# EasyEDA Pro project ProPrj_stm32人脸识别门禁系统_2026-03-19.epro

# Schematic Schematic1
Assembly Variant: Basic; Board Name: Board1; Create Date: 2026-03-06; Page Name: P1; Project Name: stm32人脸识别门禁系统; Schematic Name: Schematic1; Update Date: 2026-03-06; BladeWidth: 10; Company: 嘉立创EDA; Page Size: A4; RegionStart: 1; ShowBorder: 1; TitleBlock: 1; TitleBlockPosition: 3; Version: V1.0; XRegionCount: 6; YRegionCount: 4
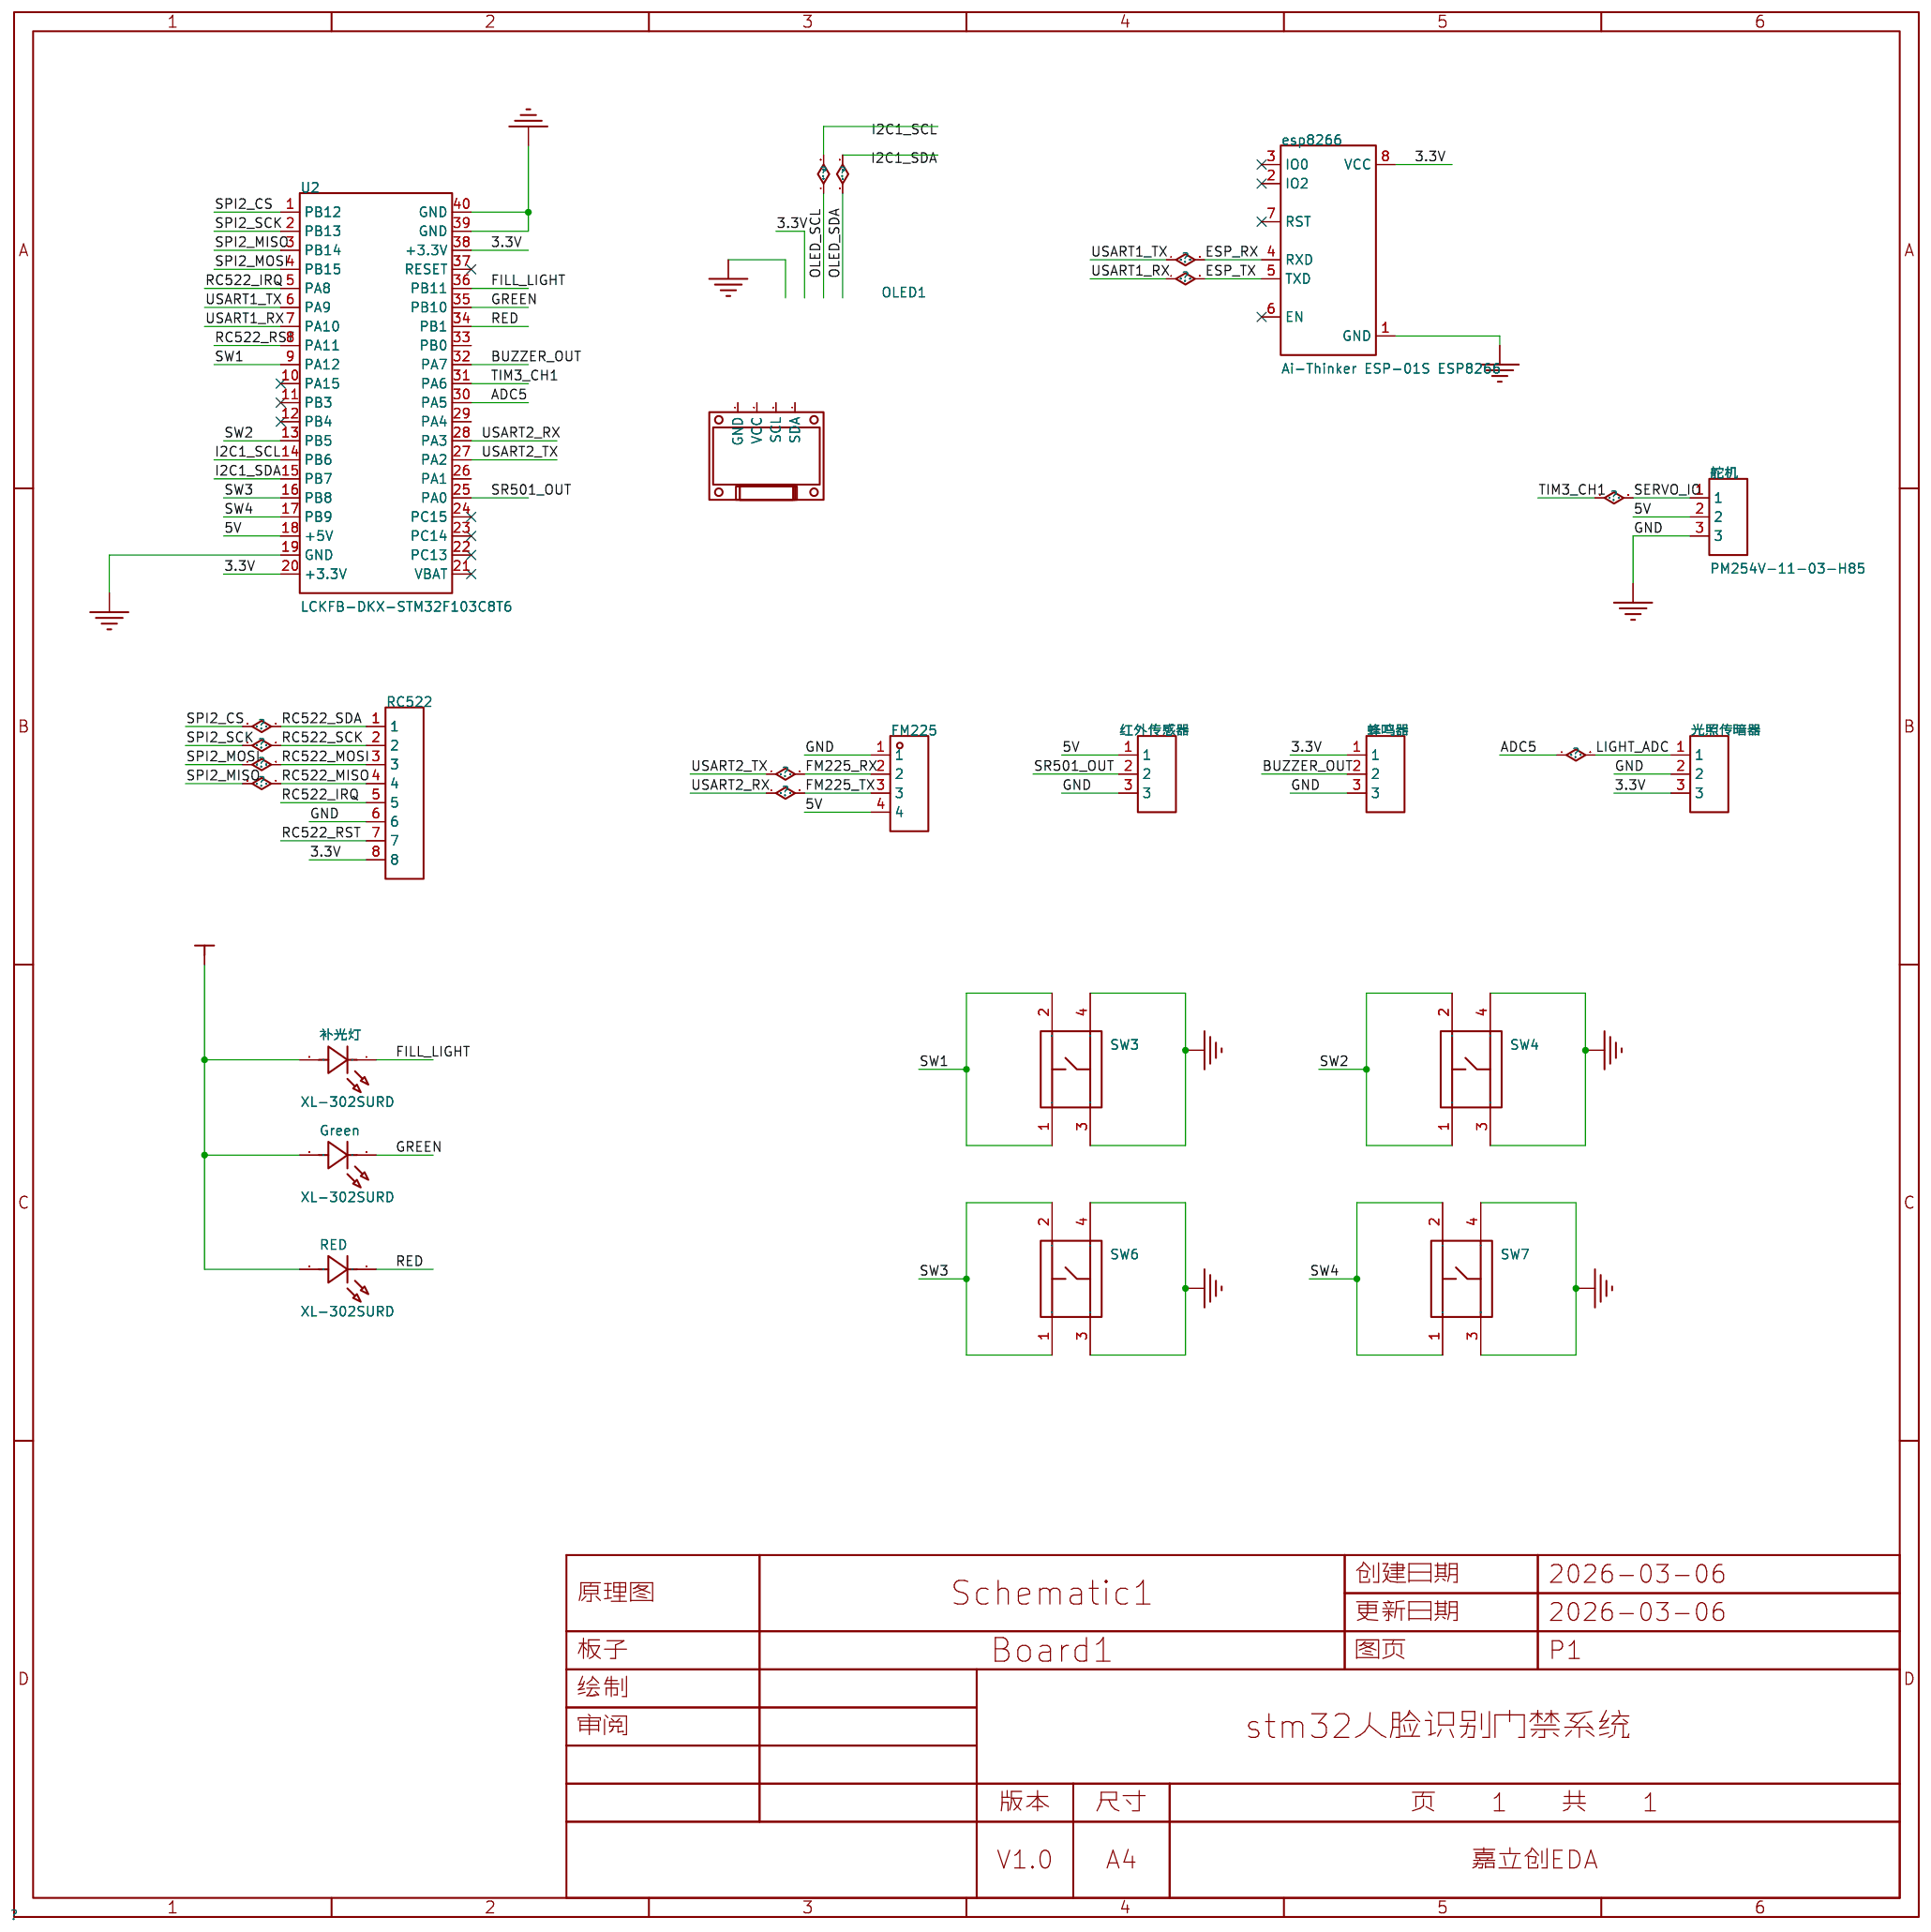
[diagram p0: schematic sheet]

## Parts
esp8266  Ai-Thinker ESP-01S ESP8266  [WIFIM-TH_8P-L24.7-W14.4-P2.54]
FM225  -  [HDR-TH_4P-P2.54-V-F]
Green  XL-302SURD  [LED-TH_BD3.8-P2.54-RD]
OLED1  -  [0.96OLED_4P]
RC522  -  [HDR-TH_8P-P2.54-V-F-1]
RED  XL-302SURD  [LED-TH_BD3.8-P2.54-RD]
SW3  K2-1102DP-C4SW-04  [KEY-TH_4P-L6.0-W6.0-P4.50-LS6.50]
SW4  K2-1102DP-C4SW-04  [KEY-TH_4P-L6.0-W6.0-P4.50-LS6.50]
SW6  K2-1102DP-C4SW-04  [KEY-TH_4P-L6.0-W6.0-P4.50-LS6.50]
SW7  K2-1102DP-C4SW-04  [KEY-TH_4P-L6.0-W6.0-P4.50-LS6.50]
U2  LCKFB-DKX-STM32F103C8T6  [CONN-TH_L53.3-W22.9_STM32F103C8T6-CARD]
光照传暗器  -  [HDR-TH_3P-P2.54-V-F]
红外传感器  -  [HDR-TH_3P-P2.54-V-F]
舵机  PM254V-11-03-H85  [HDR-TH_3P-P2.54-V-F]
蜂鸣器  -  [HDR-TH_3P-P2.54-V-F]
补光灯  XL-302SURD  [LED-TH_BD3.8-P2.54-RD]

## Library data of the parts
esp8266 = Ai-Thinker ESP-01S ESP8266: Supplier Part: C17606792; Manufacturer: Ai-Thinker(安信可); JLCPCB Part Class: Extended Part; Datasheet: https://item.szlcsc.com/datasheet/Ai-Thinker%2520ESP-01S%2520ESP8266/18736031.html; Supplier: LCSC
FM225 = HDR-F_2.54_1x4P: Supplier Part: C2718488; Supplier Footprint: 插件
Green RED 补光灯 = XL-302SURD: 灯头类型:3mm圆形灯头;发光颜色:红色;正向压降(Vf):2.2V;功率:50mW;正向电流:20mA;波长:620nm~630nm;二极管配置:-;透镜颜色:红色透镜;色温:-;发光强度:1000mcd;发光角度:35°;载带方式:-;工作温度:-20℃~+85℃;; LCSC Part Name: 3mm圆形灯头 红色; Supplier Part: C2895470; Manufacturer: XINGLIGHT(成兴光); Supplier Footprint: 插件,D=3mm; JLCPCB Part Class: Extended Part; Datasheet: https://item.szlcsc.com/datasheet/XL-302SURD/3136185.html; Supplier: LCSC; Lamp Holder Type: 3mm圆形灯头; Illumination Color: 红色; Voltage - Forward(Vf): 2.2V; Power(Watts): 50mW; Forward Current: 20mA; Wavelength - Dominant: 620nm~630nm; Peak Wavelength: 625nm; Lens Color: 红色透镜; Luminous Intensity: 1000mcd; Viewing Angle: 35°; Operating Temperature: -20℃~+85℃
OLED1 = 0.96OLED模块_4P: Supplier Footprint: 插件
RC522 = HDR-F_2.54_1x8P: Supplier Part: C27438; Supplier Footprint: 插件
SW3 SW4 SW6 SW7 = K2-1102DP-C4SW-04: 电路结构:单刀单掷;按钮形状:圆形按钮;作用力:2.5N;安装方式:直插;开关长度:6mm;开关宽度:6mm;开关高度:5mm;触点电流:50mA;额定电压:12V;带灯:-;工作寿命:10万次;; LCSC Part Name: 轻触按键开关6*6*5; Supplier Part: C110153; Manufacturer: 韩国韩荣; Supplier Footprint: 插件-4P,6x6mm; JLCPCB Part Class: Extended Part; Datasheet: https://item.szlcsc.com/datasheet/K2-1102DP-C4SW-04/111374.html; Supplier: LCSC; Circuit: 单刀单掷; Actuator Style: 圆形按钮; Operating Force: 2.5N; Mounting Type: 直插; Length: 6mm; Width: 6mm; Switch Height: 5mm; Contact Current: 50mA; Voltage Rating: 12V; Life: 10万次; Operating Temperature: -25℃~+85℃
U2 = LCKFB-DKX-STM32F103C8T6: 搭载Contex M3内核,程序存储容量64KB,RAM总容量20KB,最高72MHz主频,提供高效的计算能力和稳定的运行环境。; LCSC Part Name: 立创·地阔星-STM32F103C8T6开发板; Supplier Part: C22396880; Manufacturer: 立创开发板; JLCPCB Part Class: Extended Part; Datasheet: https://item.szlcsc.com/datasheet/LCKFB-DKX-STM32F103C8T6/24005615.html; Supplier: LCSC
光照传暗器 红外传感器 蜂鸣器 = HDR-F_2.54_1x3P: Supplier Part: C541850; Supplier Footprint: 插件
舵机 = PM254V-11-03-H85: 插孔结构:1x3P;间距:2.54mm;行距:-;圆孔/方孔:方孔;安装方式:直插;排数:单排;总孔位数:3P;额定电流:3A;插孔方向:顶部;塑高:8.5mm;触头材质:黄铜;触头镀层:-;工作温度:-40℃~+105℃;; LCSC Part Name: 1x3P 间距:2.54mm 直插; Supplier Part: C541850; Manufacturer: XFCN(兴飞); Supplier Footprint: 插件,P=2.54mm; JLCPCB Part Class: Extended Part; Datasheet: https://item.szlcsc.com/datasheet/PM254V-11-03-H85/562471.html; Supplier: LCSC; Holes Structure: 1x3P; Pitch: 2.54mm; Circular Hole / Square Hole: 方孔; Mounting Type: 直插; Number of Rows: 单排; Number of Positions: 3P; Current Rating: 3A; Holes Direction: 顶部; Insulation Height: 8.5mm; Contact Material: 黄铜; Operating Temperature: -40℃~+105℃

## Nets
3.3V: esp8266.8(VCC) Green.2(A) RC522.8 RED.2(A) U2.20(+3.3V) U2.38(+3.3V) 光照传暗器.3 蜂鸣器.1 补光灯.2(A)
5V: FM225.4 U2.18(+5V) 红外传感器.1 舵机.2
GND: esp8266.1(GND) FM225.1 RC522.6 SW3.3 SW3.4 SW4.3 SW4.4 SW6.3 SW6.4 SW7.3 SW7.4 U2.19(GND) U2.39(GND) U2.40(GND) 光照传暗器.2 红外传感器.3 舵机.3 蜂鸣器.3
ADC5: U2.30(PA5) 光照传暗器.1
BUZZER_OUT: U2.32(PA7) 蜂鸣器.2
ESP_RX: esp8266.4(RXD) U2.6(PA9)
ESP_TX: esp8266.5(TXD) U2.7(PA10)
FILL_LIGHT: U2.36(PB11) 补光灯.1(K)
FM225_RX: FM225.2 U2.27(PA2)
FM225_TX: FM225.3 U2.28(PA3)
GREEN: Green.1(K) U2.35(PB10)
I2C1_SCL: U2.14(PB6)
I2C1_SDA: U2.15(PB7)
RC522_IRQ: RC522.5 U2.5(PA8)
RC522_MISO: RC522.4 U2.3(PB14)
RC522_MOSI: RC522.3 U2.4(PB15)
RC522_RST: RC522.7 U2.8(PA11)
RC522_SCK: RC522.2 U2.2(PB13)
RC522_SDA: RC522.1 U2.1(PB12)
RED: RED.1(K) U2.34(PB1)
SERVO_IO: U2.31(PA6) 舵机.1
SR501_OUT: U2.25(PA0) 红外传感器.2
SW1: SW3.1 SW3.2 U2.9(PA12)
SW2: SW4.1 SW4.2 U2.13(PB5)
SW3: SW6.1 SW6.2 U2.16(PB8)
SW4: SW7.1 SW7.2 U2.17(PB9)

Not connected (* = marked no-connect by the designer): esp8266 2(IO2)* 3(IO0)* 6(EN)* 7(RST)*; OLED1 1(GND) 2(VCC) 3(SCL) 4(SDA); U2 10(PA15)* 11(PB3)* 12(PB4)* 21(VBAT)* 22(PC13)* 23(PC14)* 24(PC15)* 26(PA1) 29(PA4) 33(PB0) 37(RESET)*

# Board PCB1
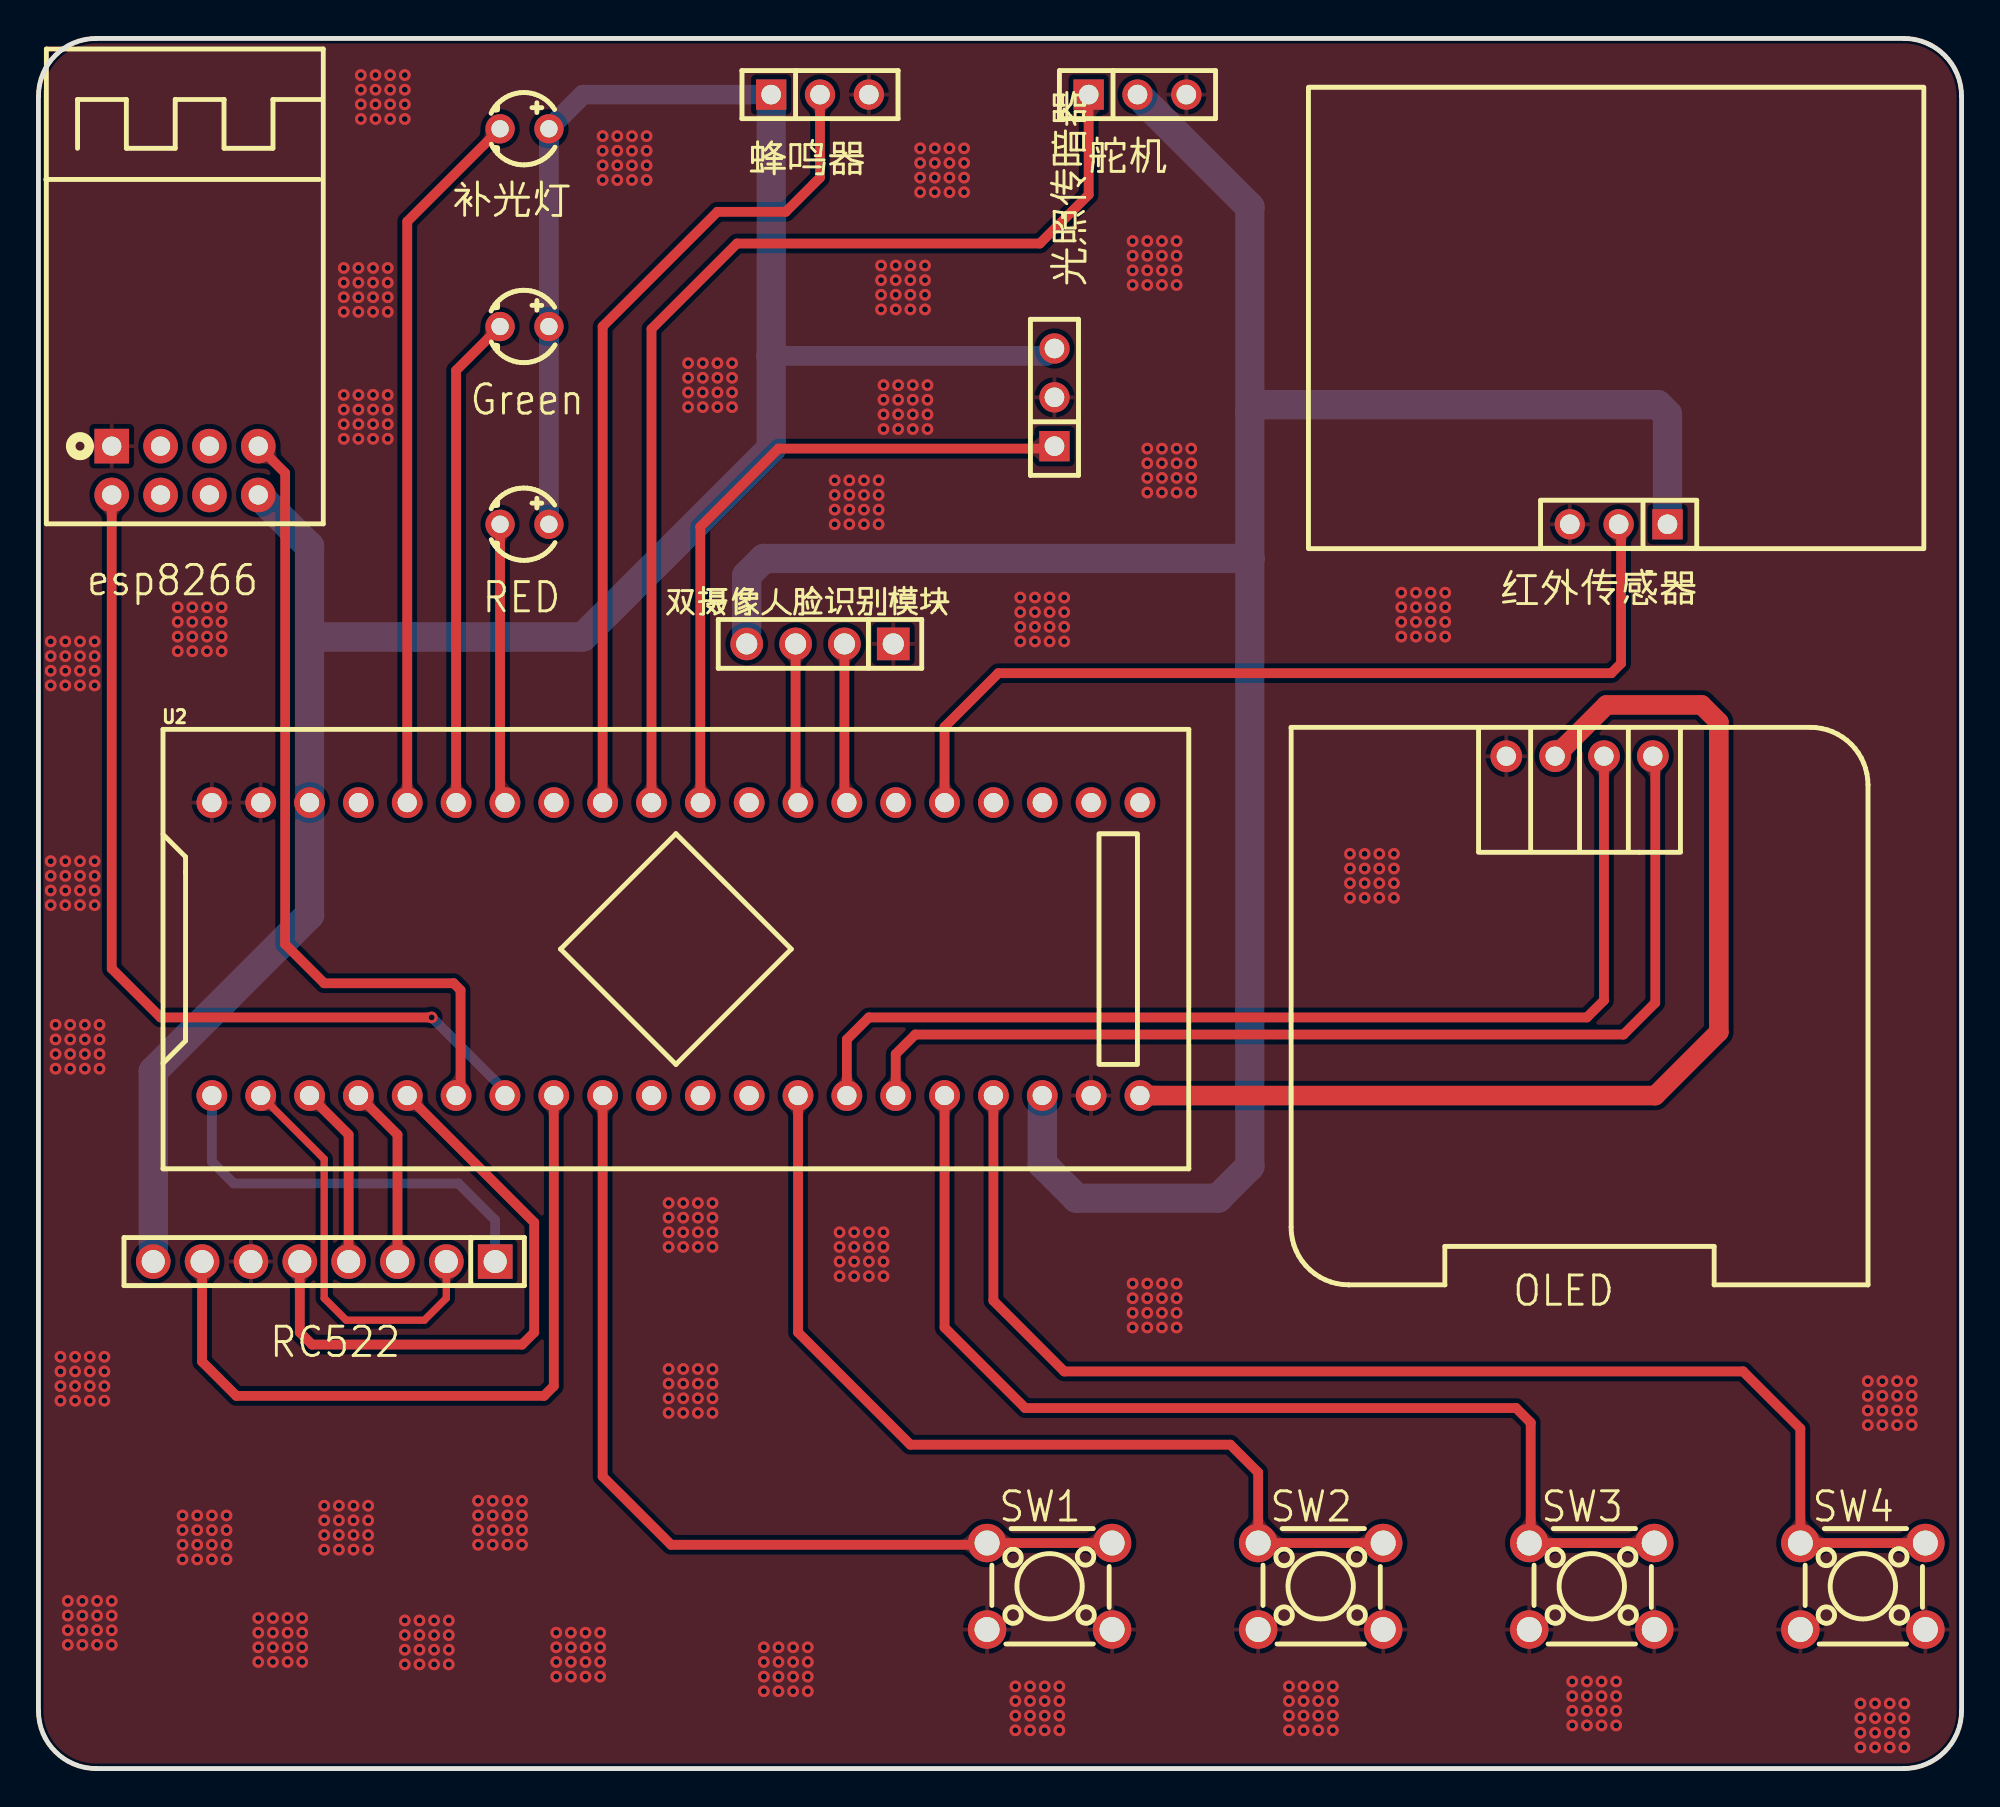
[diagram p1: board, top side]
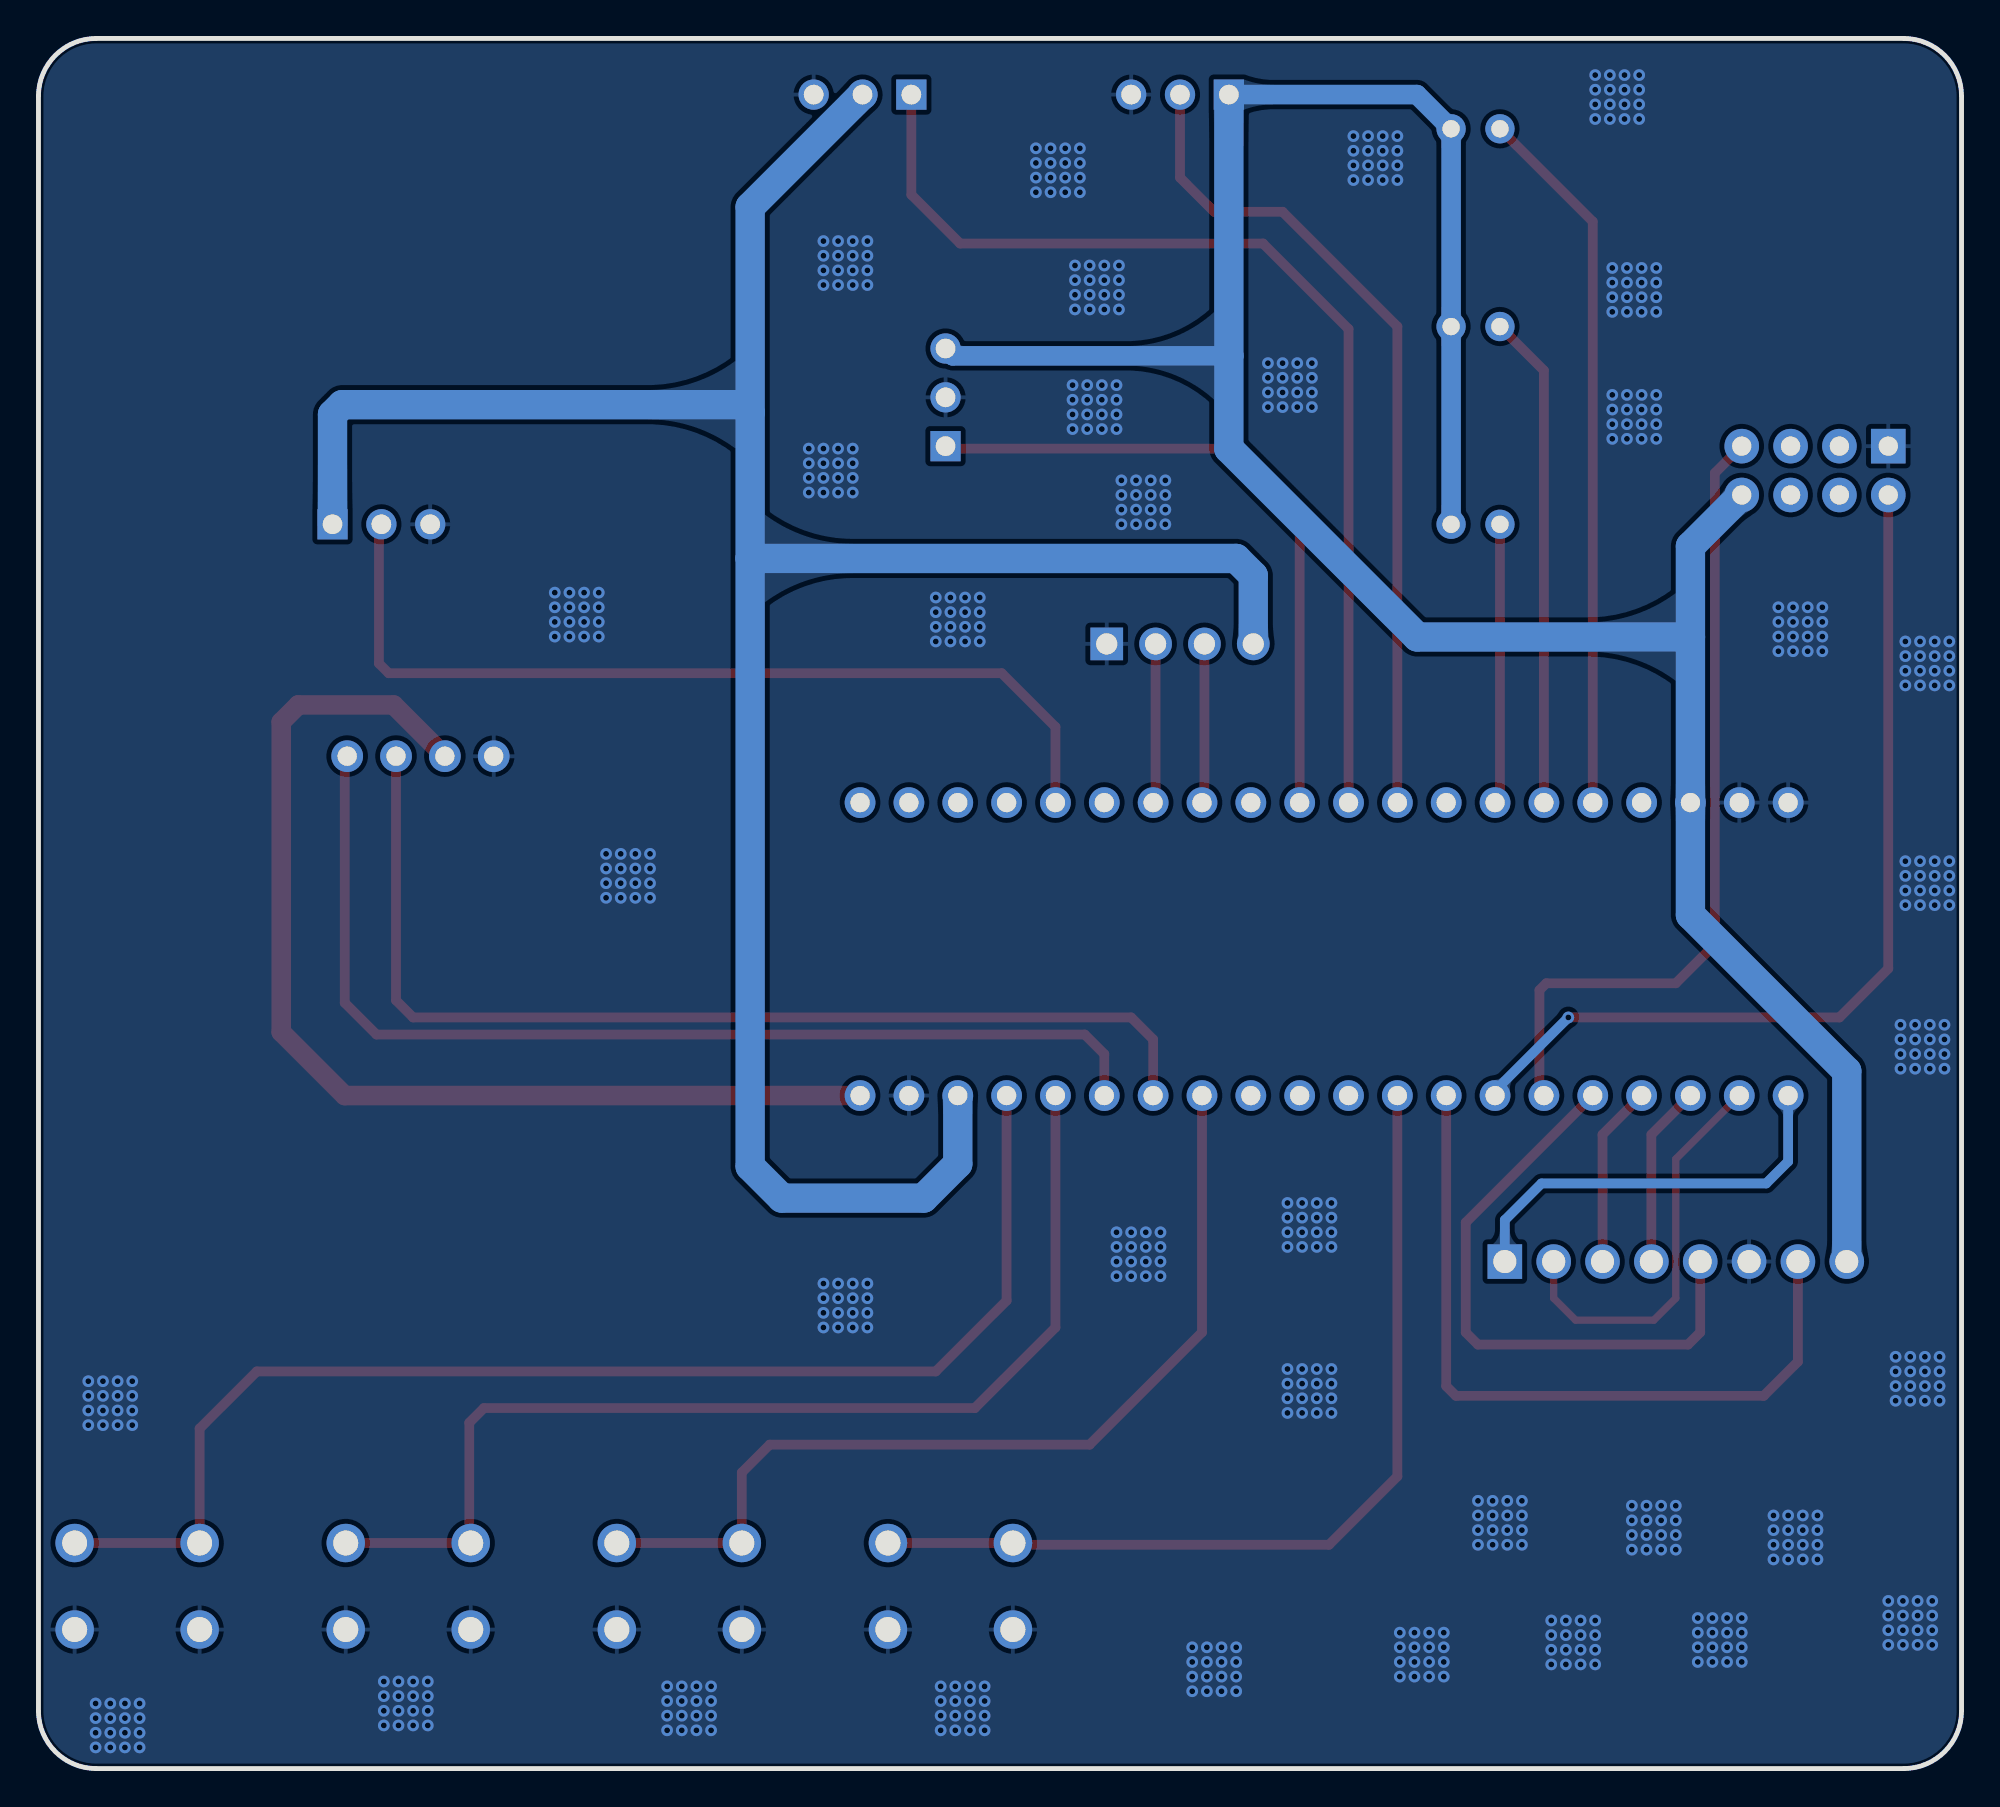
[diagram p2: board, bottom side, seen from below]

Outline 100 x 90 mm; copper layers: Top Layer, Bottom Layer. Coordinates in mm from the lower left corner of the outline.
Outline path: 0,87 0,3 arc(0.88,0.88) 3,0 97,0 arc(99.12,0.88) 100,3 100,87 arc(99.12,89.12) 97,90 3,90 arc(0.88,89.12) 0,87
Stack: Top Layer 0.035mm / Dielectric1 1.51mm FR4 er 4.5 / Bottom Layer 0.035mm

## Design rules (mm)
spacing copperThickness1oz (default): track to track 0.102, other pairs 0.152 to 0.3
spacing copperThickness2oz: track to track 0.203, other pairs 0.152 to 0.3
track width copperThickness1oz (default): min 0.127, default 0.254, max 2.54
track width copperThickness2oz: min 0.203, default 0.254, max 2.54
differential pair differentialPair (default): width min 0.127, default 0.254, max 2.54; gap min 0.152, default 0.152
net GND uses copperRegion

## Placement (name value [footprint] x y rotation side)
esp8266  Ai-Thinker ESP-01S ESP8266  [WIFIM-TH_8P-L24.7-W14.4-P2.54]  7.62 67.52 90 top
Green  XL-302SURD  [LED-TH_BD3.8-P2.54-RD]  25.27 75.01 0 top
OLED  -  [0.96OLED_4P]  80.14 52.66 0 top
RC522  -  [HDR-TH_8P-P2.54-V-F-1]  14.86 26.37 180 top
RED  XL-302SURD  [LED-TH_BD3.8-P2.54-RD]  25.27 64.73 0 top
SW1  K2-1102DP-C4SW-04  [KEY-TH_4P-L6.0-W6.0-P4.50-LS6.50]  52.58 9.48 0 top
SW2  K2-1102DP-C4SW-04  [KEY-TH_4P-L6.0-W6.0-P4.50-LS6.50]  66.68 9.48 0 top
SW3  K2-1102DP-C4SW-04  [KEY-TH_4P-L6.0-W6.0-P4.50-LS6.50]  80.77 9.48 0 top
SW4  K2-1102DP-C4SW-04  [KEY-TH_4P-L6.0-W6.0-P4.50-LS6.50]  94.87 9.48 0 top
U2  LCKFB-DKX-STM32F103C8T6  [CONN-TH_L53.3-W22.9_STM32F103C8T6-CARD]  33.15 42.63 0 top
光照传暗器  -  [HDR-TH_3P-P2.54-V-F]  52.83 71.33 90 top
双摄像人脸识别模块  -  [HDR-TH_4P-P2.54-V-F]  40.64 58.5 180 top
红外传感器  -  [HDR-TH_3P-P2.54-V-F]  82.17 64.73 180 top
舵机  PM254V-11-03-H85  [HDR-TH_3P-P2.54-V-F]  57.15 87.08 0 top
蜂鸣器  -  [HDR-TH_3P-P2.54-V-F]  40.64 87.08 0 top
补光灯  XL-302SURD  [LED-TH_BD3.8-P2.54-RD]  25.27 85.3 0 top

## Footprints (pads in the part's own frame, mm; a bottom-side part is the same pattern mirrored in y, then rotated)
0.96OLED_4P
  round 1.65 hole 1: 1(-3.81,-0.002) 2(-1.27,0.002) 3(1.27,0.002) 4(3.81,0.002)
CONN-TH_L53.3-W22.9_STM32F103C8T6-CARD
  round 1.6 hole 1: 1(-24.13,-7.62) 2(-21.59,-7.62) 3(-19.05,-7.62) 4(-16.51,-7.62) 5(-13.97,-7.62) 6(-11.43,-7.62) 7(-8.89,-7.62) 8(-6.35,-7.62) 9(-3.81,-7.62) 10(-1.27,-7.62) 11(1.27,-7.62) 12(3.81,-7.62) 13(6.35,-7.62) 14(8.89,-7.62) 15(11.43,-7.62) 16(13.97,-7.62) 17(16.51,-7.62) 18(19.05,-7.62) 19(21.59,-7.62) 20(24.13,-7.62) 21(24.13,7.62) 22(21.59,7.62) 23(19.05,7.62) 24(16.51,7.62) 25(13.97,7.62) 26(11.43,7.62) 27(8.89,7.62) 28(6.35,7.62) 29(3.81,7.62) 30(1.27,7.62) 31(-1.27,7.62) 32(-3.81,7.62) 33(-6.35,7.62) 34(-8.89,7.62) 35(-11.43,7.62) 36(-13.97,7.62) 37(-16.51,7.62) 38(-19.05,7.62) 39(-21.59,7.62) 40(-24.13,7.62)
HDR-TH_3P-P2.54-V-F
  rect 1.575x1.575 hole 1.02: 1(-2.54,0)
  round 1.575 hole 1.02: 2(0,0) 3(2.54,0)
HDR-TH_4P-P2.54-V-F
  rect 1.7x1.7 hole 1.1: 1(-3.81,0)
  round 1.7 hole 1.1: 2(-1.27,0) 3(1.27,0) 4(3.81,0)
HDR-TH_8P-P2.54-V-F-1
  rect 1.8x1.8 hole 1.2: 1(-8.89,0)
  round 1.8 hole 1.2: 2(-6.35,0) 3(-3.81,0) 4(-1.27,0) 5(1.27,0) 6(3.81,0) 7(6.35,0) 8(8.89,0)
KEY-TH_4P-L6.0-W6.0-P4.50-LS6.50
  round 2 hole 1.3: 1(-3.25,2.25) 2(3.25,2.25) 3(-3.25,-2.25) 4(3.25,-2.25)
LED-TH_BD3.8-P2.54-RD
  round 1.524 hole 0.9: 1(-1.27,0) 2(1.27,0)
WIFIM-TH_8P-L24.7-W14.4-P2.54
  rect 1.8x1.8 hole 1: 1(1.27,3.81)
  round 1.8 hole 1: 2(1.27,1.27) 3(1.27,-1.27) 4(1.27,-3.81) 5(-1.27,3.81) 6(-1.27,1.27) 7(-1.27,-1.27) 8(-1.27,-3.81)

## Nets
3.3V: esp8266.8 Green.2 OLED.2 RC522.8 RED.2 U2.20 U2.38 光照传暗器.3 蜂鸣器.1 补光灯.2
5V: U2.18 双摄像人脸识别模块.4 红外传感器.1 舵机.2
GND: esp8266.1 OLED.1 RC522.6 SW1.3 SW1.4 SW2.3 SW2.4 SW3.3 SW3.4 SW4.3 SW4.4 U2.19 U2.39 U2.40 光照传暗器.2 双摄像人脸识别模块.1 红外传感器.3 舵机.3 蜂鸣器.3
ADC5: U2.30 光照传暗器.1
BUZZER_OUT: U2.32 蜂鸣器.2
ESP_RX: esp8266.4 U2.6
ESP_TX: esp8266.5 U2.7
FILL_LIGHT: U2.36 补光灯.1
FM225_RX: U2.27 双摄像人脸识别模块.2
FM225_TX: U2.28 双摄像人脸识别模块.3
GREEN: Green.1 U2.35
I2C1_SCL: OLED.3 U2.14
I2C1_SDA: OLED.4 U2.15
RC522_IRQ: RC522.5 U2.5
RC522_MISO: RC522.4 U2.3
RC522_MOSI: RC522.3 U2.4
RC522_RST: RC522.7 U2.8
RC522_SCK: RC522.2 U2.2
RC522_SDA: RC522.1 U2.1
RED: RED.1 U2.34
SERVO_IO: U2.31 舵机.1
SR501_OUT: U2.25 红外传感器.2
SW1: SW1.1 SW1.2 U2.9
SW2: SW2.1 SW2.2 U2.13
SW3: SW3.1 SW3.2 U2.16
SW4: SW4.1 SW4.2 U2.17

Pads without a net: esp8266 2 3 6 7; U2 10 11 12 21 22 23 24 26 29 33 37

## Via types
v1: diameter 0.61, hole 0.305, Top Layer to Bottom Layer, 577 vias

## Routing (per net, layer and track width the routed paths; a pad name or vN(x,y) marks a point on that pad's centre or on a via; arc(x,y) is an arc through that point)
3.3V: length 196.4
  Top Layer w1.016: OLED.2 81.53,55.33 86.49,55.33 87.38,54.44 87.38,38.31 84.07,35.01 U2.20
  Bottom Layer w1.016: 26.54,64.73 26.54,85.3 28.32,87.08 蜂鸣器.1 ; 37.85,73.49 52.45,73.49 光照传暗器.3
  Bottom Layer w1.524: 14.1,58.87 28.3,58.87 38.1,68.66 蜂鸣器.1 ; 14.1,58.87 14.1,63.58 esp8266.8 ; 14.1,58.87 14.1,44.41 5.97,36.28 RC522.8
5V: length 131.8
  Bottom Layer w1.524: 62.99,70.55 63.39,70.95 84.2,70.95 84.71,70.44 红外传感器.1 ; 62.99,70.55 62.99,62.97 ; 62.99,70.55 62.99,81.24 舵机.2 ; U2.18 52.2,31.45 53.97,29.67 61.34,29.67 62.99,31.33 62.99,62.97 ; 62.99,62.97 62.98,62.95 37.72,62.95 36.83,62.06 双摄像人脸识别模块.4
GND:
  vias: v1(0.64,58.63) v1(0.64,57.87) v1(0.64,57.11) v1(0.64,56.34) v1(0.64,47.2) v1(0.64,46.44) v1(0.64,45.68) v1(0.64,44.92) v1(0.89,38.69) v1(0.89,37.93) v1(0.89,37.17) v1(0.89,36.41) v1(1.14,21.42) v1(1.14,20.66) v1(1.14,19.9) v1(1.14,19.13) v1(1.4,58.63) v1(1.4,57.87) v1(1.4,57.11) v1(1.4,56.34) v1(1.4,47.2) v1(1.4,46.44) v1(1.4,45.68) v1(1.4,44.92) v1(1.52,8.72) v1(1.52,7.96) v1(1.52,7.2) v1(1.52,6.43) v1(1.65,38.69) v1(1.65,37.93) v1(1.65,37.17) v1(1.65,36.41) v1(1.91,21.42) v1(1.91,20.66) v1(1.91,19.9) v1(1.91,19.13) v1(2.16,58.63) v1(2.16,57.87) v1(2.16,57.11) v1(2.16,56.34) v1(2.16,47.2) v1(2.16,46.44) v1(2.16,45.68) v1(2.16,44.92) v1(2.29,8.72) v1(2.29,7.96) v1(2.29,7.2) v1(2.29,6.43) v1(2.41,38.69) v1(2.41,37.93) v1(2.41,37.17) v1(2.41,36.41) v1(2.67,21.42) v1(2.67,20.66) v1(2.67,19.9) v1(2.67,19.13) v1(2.92,58.63) v1(2.92,57.87) v1(2.92,57.11) v1(2.92,56.34) v1(2.92,47.2) v1(2.92,46.44) v1(2.92,45.68) v1(2.92,44.92) v1(3.05,8.72) v1(3.05,7.96) v1(3.05,7.2) v1(3.05,6.43) v1(3.17,38.69) v1(3.17,37.93) v1(3.17,37.17) v1(3.17,36.41) v1(3.43,21.42) v1(3.43,20.66) v1(3.43,19.9) v1(3.43,19.13) v1(3.81,8.72) v1(3.81,7.96) v1(3.81,7.2) v1(3.81,6.43) v1(7.24,60.41) v1(7.24,59.65) v1(7.24,58.89) v1(7.24,58.12) v1(7.49,13.16) v1(7.49,12.4) v1(7.49,11.64) v1(7.49,10.88) v1(8,60.41) v1(8,59.65) v1(8,58.89) v1(8,58.12) v1(8.25,13.16) v1(8.25,12.4) v1(8.25,11.64) v1(8.25,10.88) v1(8.76,60.41) v1(8.76,59.65) v1(8.76,58.89) v1(8.76,58.12) v1(9.02,13.16) v1(9.02,12.4) v1(9.02,11.64) v1(9.02,10.88) v1(9.53,60.41) v1(9.53,59.65) v1(9.53,58.89) v1(9.53,58.12) v1(9.78,13.16) v1(9.78,12.4) v1(9.78,11.64) v1(9.78,10.88) v1(11.43,7.83) v1(11.43,7.07) v1(11.43,6.31) v1(11.43,5.54) v1(12.19,7.83) v1(12.19,7.07) v1(12.19,6.31) v1(12.19,5.54) v1(12.95,7.83) v1(12.95,7.07) v1(12.95,6.31) v1(12.95,5.54) v1(13.72,7.83) v1(13.72,7.07) v1(13.72,6.31) v1(13.72,5.54) v1(14.86,13.67) v1(14.86,12.91) v1(14.86,12.15) v1(14.86,11.39) v1(15.62,13.67) v1(15.62,12.91) v1(15.62,12.15) v1(15.62,11.39) v1(15.88,78.06) v1(15.88,77.3) v1(15.88,76.54) v1(15.88,75.78) v1(15.88,71.46) v1(15.88,70.7) v1(15.88,69.93) v1(15.88,69.17) v1(16.38,13.67) v1(16.38,12.91) v1(16.38,12.15) v1(16.38,11.39) v1(16.64,78.06) v1(16.64,77.3) v1(16.64,76.54) v1(16.64,75.78) v1(16.64,71.46) v1(16.64,70.7) v1(16.64,69.93) v1(16.64,69.17) v1(16.76,88.09) v1(16.76,87.33) v1(16.76,86.57) v1(16.76,85.81) v1(17.14,13.67) v1(17.14,12.91) v1(17.14,12.15) v1(17.14,11.39) v1(17.4,78.06) v1(17.4,77.3) v1(17.4,76.54) v1(17.4,75.78) v1(17.4,71.46) v1(17.4,70.7) v1(17.4,69.93) v1(17.4,69.17) v1(17.53,88.09) v1(17.53,87.33) v1(17.53,86.57) v1(17.53,85.81) v1(18.16,78.06) v1(18.16,77.3) v1(18.16,76.54) v1(18.16,75.78) v1(18.16,71.46) v1(18.16,70.7) v1(18.16,69.93) v1(18.16,69.17) v1(18.29,88.09) v1(18.29,87.33) v1(18.29,86.57) v1(18.29,85.81) v1(19.05,88.09) v1(19.05,87.33) v1(19.05,86.57) v1(19.05,85.81) v1(19.05,7.7) v1(19.05,6.94) v1(19.05,6.18) v1(19.05,5.42) v1(19.81,7.7) v1(19.81,6.94) v1(19.81,6.18) v1(19.81,5.42) v1(20.57,7.7) v1(20.57,6.94) v1(20.57,6.18) v1(20.57,5.42) v1(21.34,7.7) v1(21.34,6.94) v1(21.34,6.18) v1(21.34,5.42) v1(22.86,13.93) v1(22.86,13.16) v1(22.86,12.4) v1(22.86,11.64) v1(23.62,13.93) v1(23.62,13.16) v1(23.62,12.4) v1(23.62,11.64) v1(24.38,13.93) v1(24.38,13.16) v1(24.38,12.4) v1(24.38,11.64) v1(25.15,13.93) v1(25.15,13.16) v1(25.15,12.4) v1(25.15,11.64) v1(26.92,7.07) v1(26.92,6.31) v1(26.92,5.54) v1(26.92,4.78) v1(27.69,7.07) v1(27.69,6.31) v1(27.69,5.54) v1(27.69,4.78) v1(28.45,7.07) v1(28.45,6.31) v1(28.45,5.54) v1(28.45,4.78) v1(29.21,7.07) v1(29.21,6.31) v1(29.21,5.54) v1(29.21,4.78) v1(29.34,84.92) v1(29.34,84.16) v1(29.34,83.4) v1(29.34,82.63) v1(30.1,84.92) v1(30.1,84.16) v1(30.1,83.4) v1(30.1,82.63) v1(30.86,84.92) v1(30.86,84.16) v1(30.86,83.4) v1(30.86,82.63) v1(31.62,84.92) v1(31.62,84.16) v1(31.62,83.4) v1(31.62,82.63) v1(32.77,29.42) v1(32.77,28.66) v1(32.77,27.9) v1(32.77,27.14) v1(32.77,20.78) v1(32.77,20.02) v1(32.77,19.26) v1(32.77,18.5) v1(33.53,29.42) v1(33.53,28.66) v1(33.53,27.9) v1(33.53,27.14) v1(33.53,20.78) v1(33.53,20.02) v1(33.53,19.26) v1(33.53,18.5) v1(33.78,73.11) v1(33.78,72.35) v1(33.78,71.58) v1(33.78,70.82) v1(34.29,29.42) v1(34.29,28.66) v1(34.29,27.9) v1(34.29,27.14) v1(34.29,20.78) v1(34.29,20.02) v1(34.29,19.26) v1(34.29,18.5) v1(34.54,73.11) v1(34.54,72.35) v1(34.54,71.58) v1(34.54,70.82) v1(35.05,29.42) v1(35.05,28.66) v1(35.05,27.9) v1(35.05,27.14) v1(35.05,20.78) v1(35.05,20.02) v1(35.05,19.26) v1(35.05,18.5) v1(35.31,73.11) v1(35.31,72.35) v1(35.31,71.58) v1(35.31,70.82) v1(36.07,73.11) v1(36.07,72.35) v1(36.07,71.58) v1(36.07,70.82) v1(37.72,6.31) v1(37.72,5.54) v1(37.72,4.78) v1(37.72,4.02) v1(38.48,6.31) v1(38.48,5.54) v1(38.48,4.78) v1(38.48,4.02) v1(39.24,6.31) v1(39.24,5.54) v1(39.24,4.78) v1(39.24,4.02) v1(40,6.31) v1(40,5.54) v1(40,4.78) v1(40,4.02) v1(41.4,67.01) v1(41.4,66.25) v1(41.4,65.49) v1(41.4,64.73) v1(41.66,27.9) v1(41.66,27.14) v1(41.66,26.37) v1(41.66,25.61) v1(42.16,67.01) v1(42.16,66.25) v1(42.16,65.49) v1(42.16,64.73) v1(42.42,27.9) v1(42.42,27.14) v1(42.42,26.37) v1(42.42,25.61) v1(42.93,67.01) v1(42.93,66.25) v1(42.93,65.49) v1(42.93,64.73) v1(43.18,27.9) v1(43.18,27.14) v1(43.18,26.37) v1(43.18,25.61) v1(43.69,67.01) v1(43.69,66.25) v1(43.69,65.49) v1(43.69,64.73) v1(43.81,78.19) v1(43.81,77.43) v1(43.81,76.67) v1(43.81,75.9) v1(43.94,71.97) v1(43.94,71.2) v1(43.94,70.44) v1(43.94,69.68) v1(43.94,27.9) v1(43.94,27.14) v1(43.94,26.37) v1(43.94,25.61) v1(44.58,78.19) v1(44.58,77.43) v1(44.58,76.67) v1(44.58,75.9) v1(44.7,71.97) v1(44.7,71.2) v1(44.7,70.44) v1(44.7,69.68) v1(45.34,78.19) v1(45.34,77.43) v1(45.34,76.67) v1(45.34,75.9) v1(45.47,71.97) v1(45.47,71.2) v1(45.47,70.44) v1(45.47,69.68) v1(45.85,84.28) v1(45.85,83.52) v1(45.85,82.76) v1(45.85,82) v1(46.1,78.19) v1(46.1,77.43) v1(46.1,76.67) v1(46.1,75.9) v1(46.23,71.97) v1(46.23,71.2) v1(46.23,70.44) v1(46.23,69.68) v1(46.61,84.28) v1(46.61,83.52) v1(46.61,82.76) v1(46.61,82) v1(47.37,84.28) v1(47.37,83.52) v1(47.37,82.76) v1(47.37,82) v1(48.13,84.28) v1(48.13,83.52) v1(48.13,82.76) v1(48.13,82) v1(50.8,4.28) v1(50.8,3.51) v1(50.8,2.75) v1(50.8,1.99) v1(51.05,60.92) v1(51.05,60.16) v1(51.05,59.39) v1(51.05,58.63) v1(51.56,4.28) v1(51.56,3.51) v1(51.56,2.75) v1(51.56,1.99) v1(51.82,60.92) v1(51.82,60.16) v1(51.82,59.39) v1(51.82,58.63) v1(52.32,4.28) v1(52.32,3.51) v1(52.32,2.75) v1(52.32,1.99) v1(52.58,60.92) v1(52.58,60.16) v1(52.58,59.39) v1(52.58,58.63) v1(53.09,4.28) v1(53.09,3.51) v1(53.09,2.75) v1(53.09,1.99) v1(53.34,60.92) v1(53.34,60.16) v1(53.34,59.39) v1(53.34,58.63) v1(56.9,79.46) v1(56.9,78.7) v1(56.9,77.94) v1(56.9,77.17) v1(56.9,25.23) v1(56.9,24.47) v1(56.9,23.71) v1(56.9,22.94) v1(57.66,79.46) v1(57.66,78.7) v1(57.66,77.94) v1(57.66,77.17) v1(57.66,68.66) v1(57.66,67.9) v1(57.66,67.14) v1(57.66,66.38) v1(57.66,25.23) v1(57.66,24.47) v1(57.66,23.71) v1(57.66,22.94) v1(58.42,79.46) v1(58.42,78.7) v1(58.42,77.94) v1(58.42,77.17) v1(58.42,68.66) v1(58.42,67.9) v1(58.42,67.14) v1(58.42,66.38) v1(58.42,25.23) v1(58.42,24.47) v1(58.42,23.71) v1(58.42,22.94) v1(59.18,79.46) v1(59.18,78.7) v1(59.18,77.94) v1(59.18,77.17) v1(59.18,68.66) v1(59.18,67.9) v1(59.18,67.14) v1(59.18,66.38) v1(59.18,25.23) v1(59.18,24.47) v1(59.18,23.71) v1(59.18,22.94) v1(59.94,68.66) v1(59.94,67.9) v1(59.94,67.14) v1(59.94,66.38) v1(65.02,4.28) v1(65.02,3.51) v1(65.02,2.75) v1(65.02,1.99) v1(65.79,4.28) v1(65.79,3.51) v1(65.79,2.75) v1(65.79,1.99) v1(66.55,4.28) v1(66.55,3.51) v1(66.55,2.75) v1(66.55,1.99) v1(67.31,4.28) v1(67.31,3.51) v1(67.31,2.75) v1(67.31,1.99) v1(68.2,47.58) v1(68.2,46.82) v1(68.2,46.06) v1(68.2,45.3) v1(68.96,47.58) v1(68.96,46.82) v1(68.96,46.06) v1(68.96,45.3) v1(69.72,47.58) v1(69.72,46.82) v1(69.72,46.06) v1(69.72,45.3) v1(70.49,47.58) v1(70.49,46.82) v1(70.49,46.06) v1(70.49,45.3) v1(70.87,61.17) v1(70.87,60.41) v1(70.87,59.65) v1(70.87,58.89) v1(71.63,61.17) v1(71.63,60.41) v1(71.63,59.65) v1(71.63,58.89) v1(72.39,61.17) v1(72.39,60.41) v1(72.39,59.65) v1(72.39,58.89) v1(73.15,61.17) v1(73.15,60.41) v1(73.15,59.65) v1(73.15,58.89) v1(79.76,4.53) v1(79.76,3.77) v1(79.76,3) v1(79.76,2.24) v1(80.52,4.53) v1(80.52,3.77) v1(80.52,3) v1(80.52,2.24) v1(81.28,4.53) v1(81.28,3.77) v1(81.28,3) v1(81.28,2.24) v1(82.04,4.53) v1(82.04,3.77) v1(82.04,3) v1(82.04,2.24) v1(94.74,3.39) v1(94.74,2.62) v1(94.74,1.86) v1(94.74,1.1) v1(95.12,20.15) v1(95.12,19.39) v1(95.12,18.63) v1(95.12,17.86) v1(95.5,3.39) v1(95.5,2.62) v1(95.5,1.86) v1(95.5,1.1) v1(95.88,20.15) v1(95.88,19.39) v1(95.88,18.63) v1(95.88,17.86) v1(96.27,3.39) v1(96.27,2.62) v1(96.27,1.86) v1(96.27,1.1) v1(96.65,20.15) v1(96.65,19.39) v1(96.65,18.63) v1(96.65,17.86) v1(97.03,3.39) v1(97.03,2.62) v1(97.03,1.86) v1(97.03,1.1) v1(97.41,20.15) v1(97.41,19.39) v1(97.41,18.63) v1(97.41,17.86)
ADC5: length 34.5
  Top Layer w0.508: 34.42,50.25 34.42,64.6 38.48,68.66 52.71,68.66 光照传暗器.1
BUZZER_OUT: length 43.6
  Top Layer w0.508: 蜂鸣器.2 40.64,82.76 38.86,80.98 35.31,80.98 29.34,75.01 29.34,50.25
ESP_RX: length 42.2
  Top Layer w0.508: esp8266.4 12.83,67.39 12.83,42.88 14.86,40.85 21.59,40.85 21.95,40.49 21.95,35.24 U2.6
ESP_TX: length 48
  Top Layer w0.508: esp8266.5 3.81,41.61 6.35,39.07 v1(20.45,39.07)
  Bottom Layer w0.508: U2.7 24.26,35.26 v1(20.45,39.07)
FILL_LIGHT: length 37.1
  Top Layer w0.508: 19.18,50.25 19.18,80.47 补光灯.1
FM225_RX: length 8.3
  Top Layer w0.508: 双摄像人脸识别模块.2 41.91,50.38 42.04,50.25
FM225_TX: length 8.3
  Top Layer w0.508: 双摄像人脸识别模块.3 39.37,50.38 39.5,50.25
GREEN: length 25.7
  Top Layer w0.508: 21.72,50.25 21.72,72.73 Green.1
I2C1_SCL: length 55.8
  Top Layer w0.508: OLED.3 81.41,39.96 80.52,39.07 43.18,39.07 42.04,37.93 U2.14
I2C1_SDA: length 55.6
  Top Layer w0.508: U2.15 44.58,37.17 45.59,38.18 82.42,38.18 84.07,39.83 84.07,52.54 OLED.4
RC522_IRQ: length 31.5
  Top Layer w0.508: U2.5 25.78,28.41 25.78,22.69 25.15,22.06 14.22,22.06 13.59,22.69 RC522.5
RC522_MISO: length 9.5
  Top Layer w0.508: RC522.4 16.13,32.98 U2.3
RC522_MOSI: length 9.5
  Top Layer w0.508: U2.4 18.67,32.98 RC522.3
RC522_RST: length 39.6
  Top Layer w0.508: U2.8 26.8,19.9 26.29,19.39 10.29,19.39 8.51,21.17 RC522.7
RC522_SCK: length 21.1
  Top Layer w0.381: RC522.2 21.21,24.47 20.07,23.33 16,23.33 14.86,24.47 14.86,31.71 U2.2
RC522_SDA: length 21.6
  Bottom Layer w0.508: U2.1 9.02,31.58 10.16,30.44 21.84,30.44 23.75,28.53 RC522.1
RED: length 14.6
  Top Layer w0.508: 24.26,50.25 24,50.5 RED.1
SERVO_IO: length 55.5
  Top Layer w0.508: 31.88,50.25 31.88,74.89 36.32,79.33 52.07,79.33 54.61,81.87 舵机.1
SR501_OUT: length 47.8
  Top Layer w0.508: 红外传感器.2 82.3,64.6 82.3,57.49 81.79,56.98 49.91,56.98 47.12,54.19 47.12,50.25
SW1: length 47.8
  Top Layer w0.508: SW1.2 SW1.1 49.24,11.64 32.89,11.64 29.34,15.2 U2.9
SW2: length 49.4
  Top Layer w0.508: SW2.2 SW2.1 63.43,15.4 61.98,16.85 45.34,16.85 39.5,22.69 U2.13
SW3: length 57.4
  Top Layer w0.508: U2.16 47.12,22.94 51.31,18.75 76.84,18.75 77.6,17.99 77.6,11.81 SW3.1 SW3.2
SW4: length 67.8
  Top Layer w0.508: SW4.2 SW4.1 91.62,17.69 88.65,20.66 53.34,20.66 49.66,24.34 U2.17

## Copper pours and planes (outline as drawn; the poured copper is in the pictures)
GND on Top Layer: -16,103.46 130.56,103.46 130.56,-16.43 -16,-16.43
GND on Bottom Layer: -29.72,108.29 151.38,108.29 151.38,-27.09 -29.72,-27.09

Small or netless copper shapes (teardrops, artwork), in the pictures only: 54 on Top Layer, 24 on Bottom Layer
